# Altium schematic sheet cricket-node.SchDoc
size D; SheetNumber: 2; SheetTotal: 2
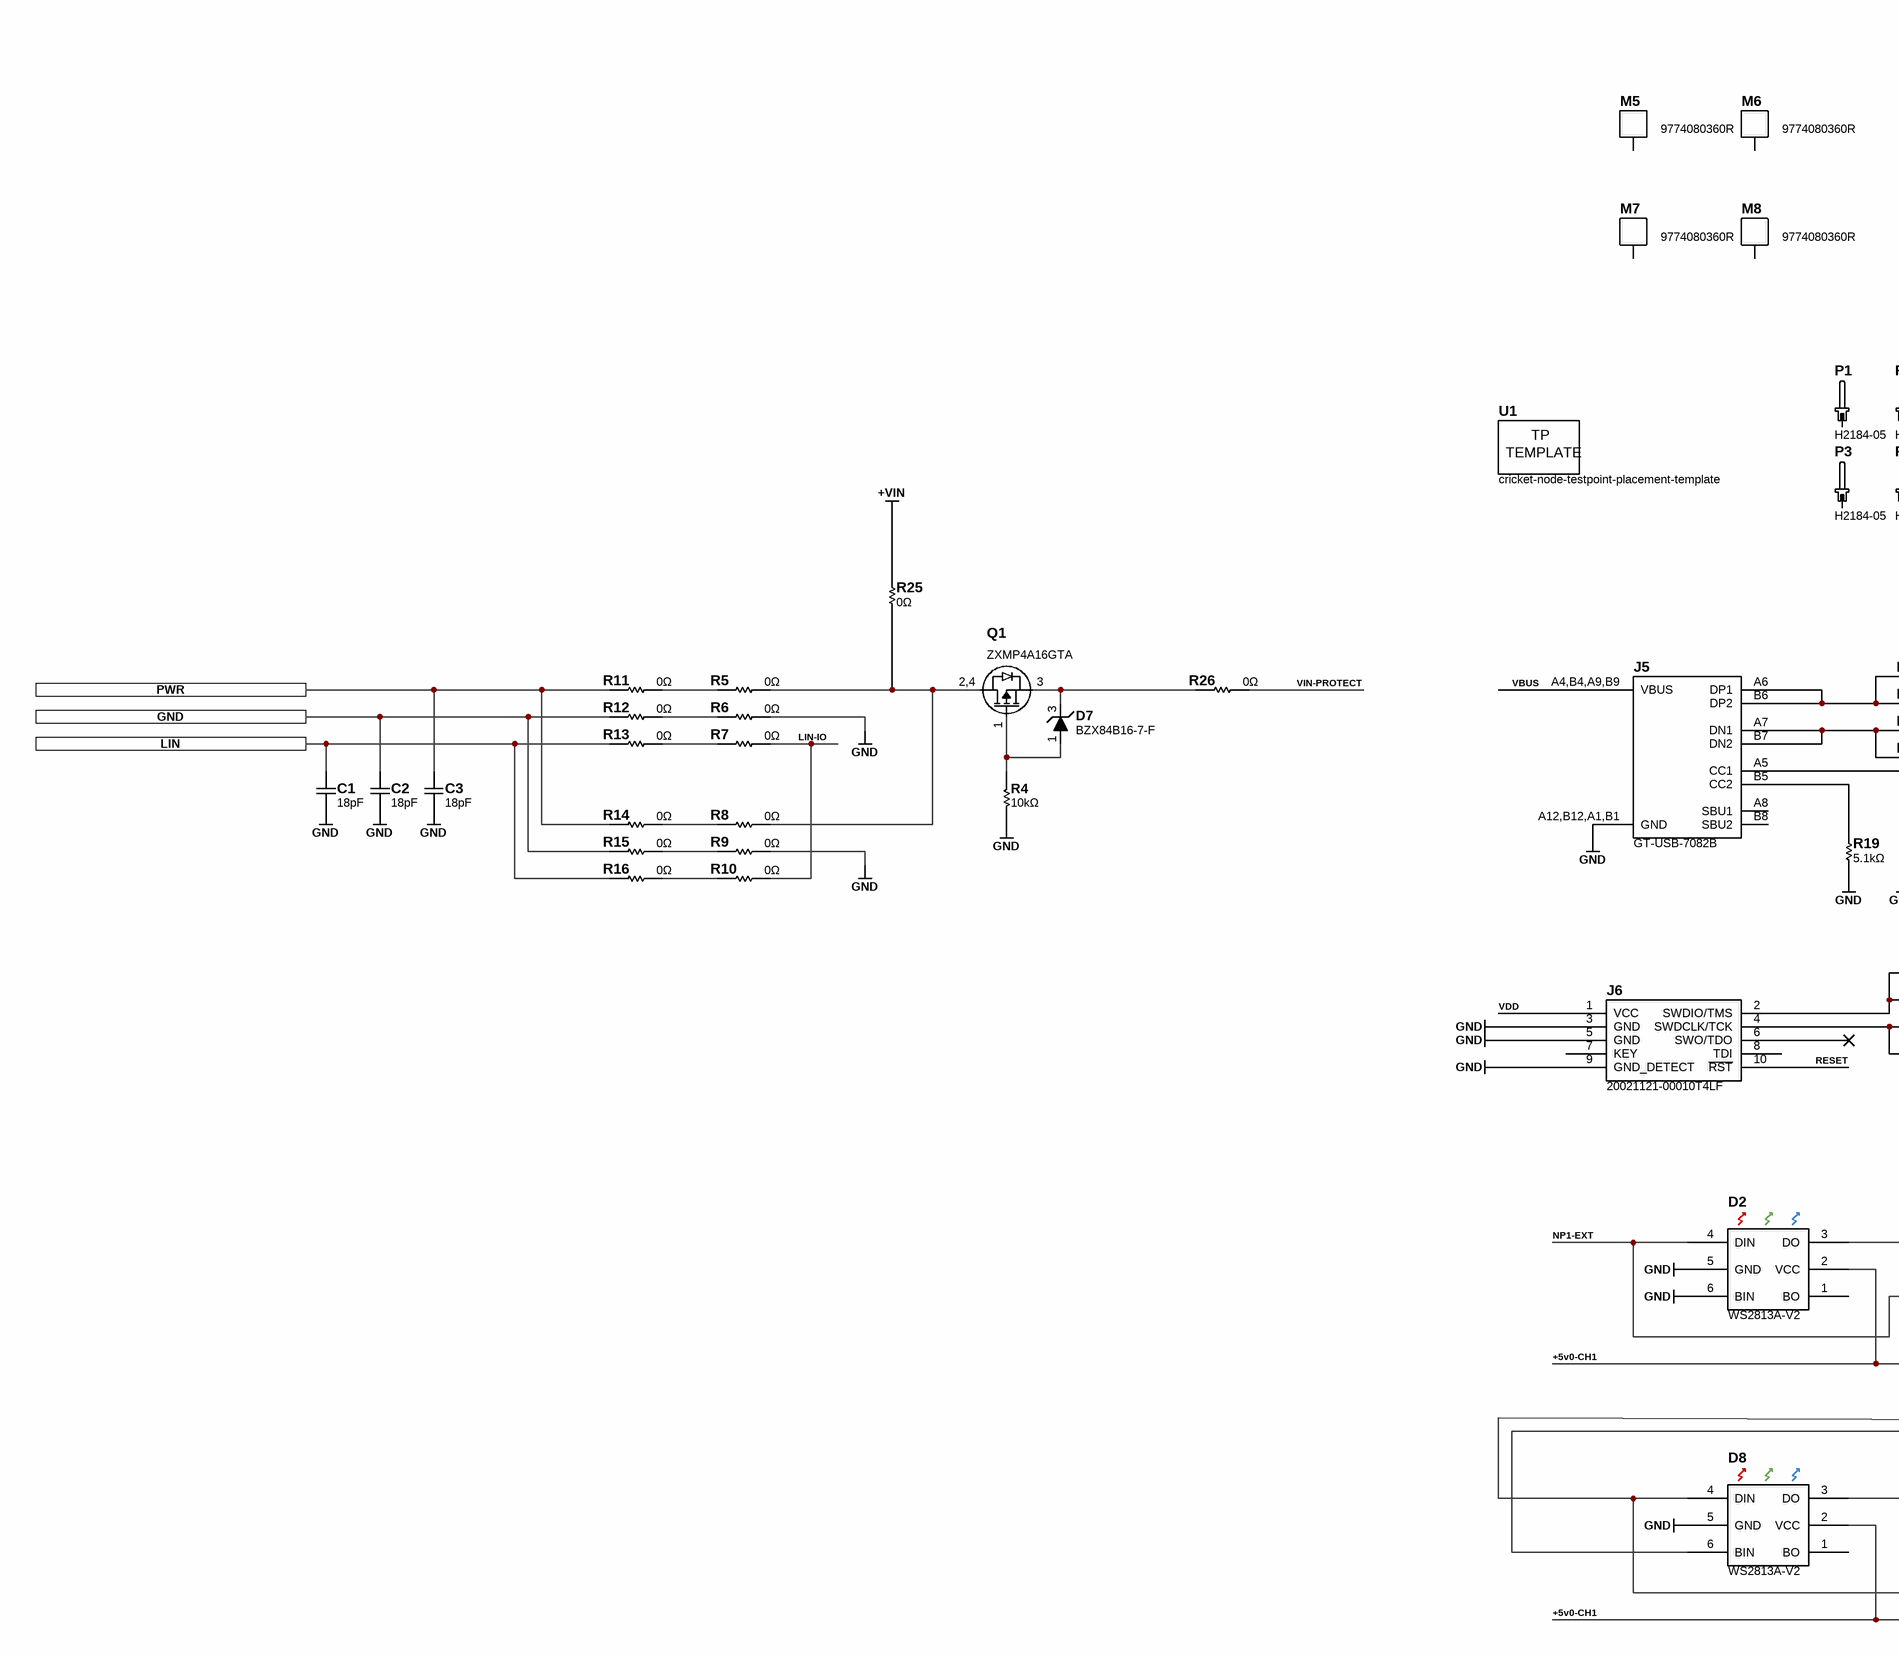
[diagram p0: cricket-node.SchDoc, left]
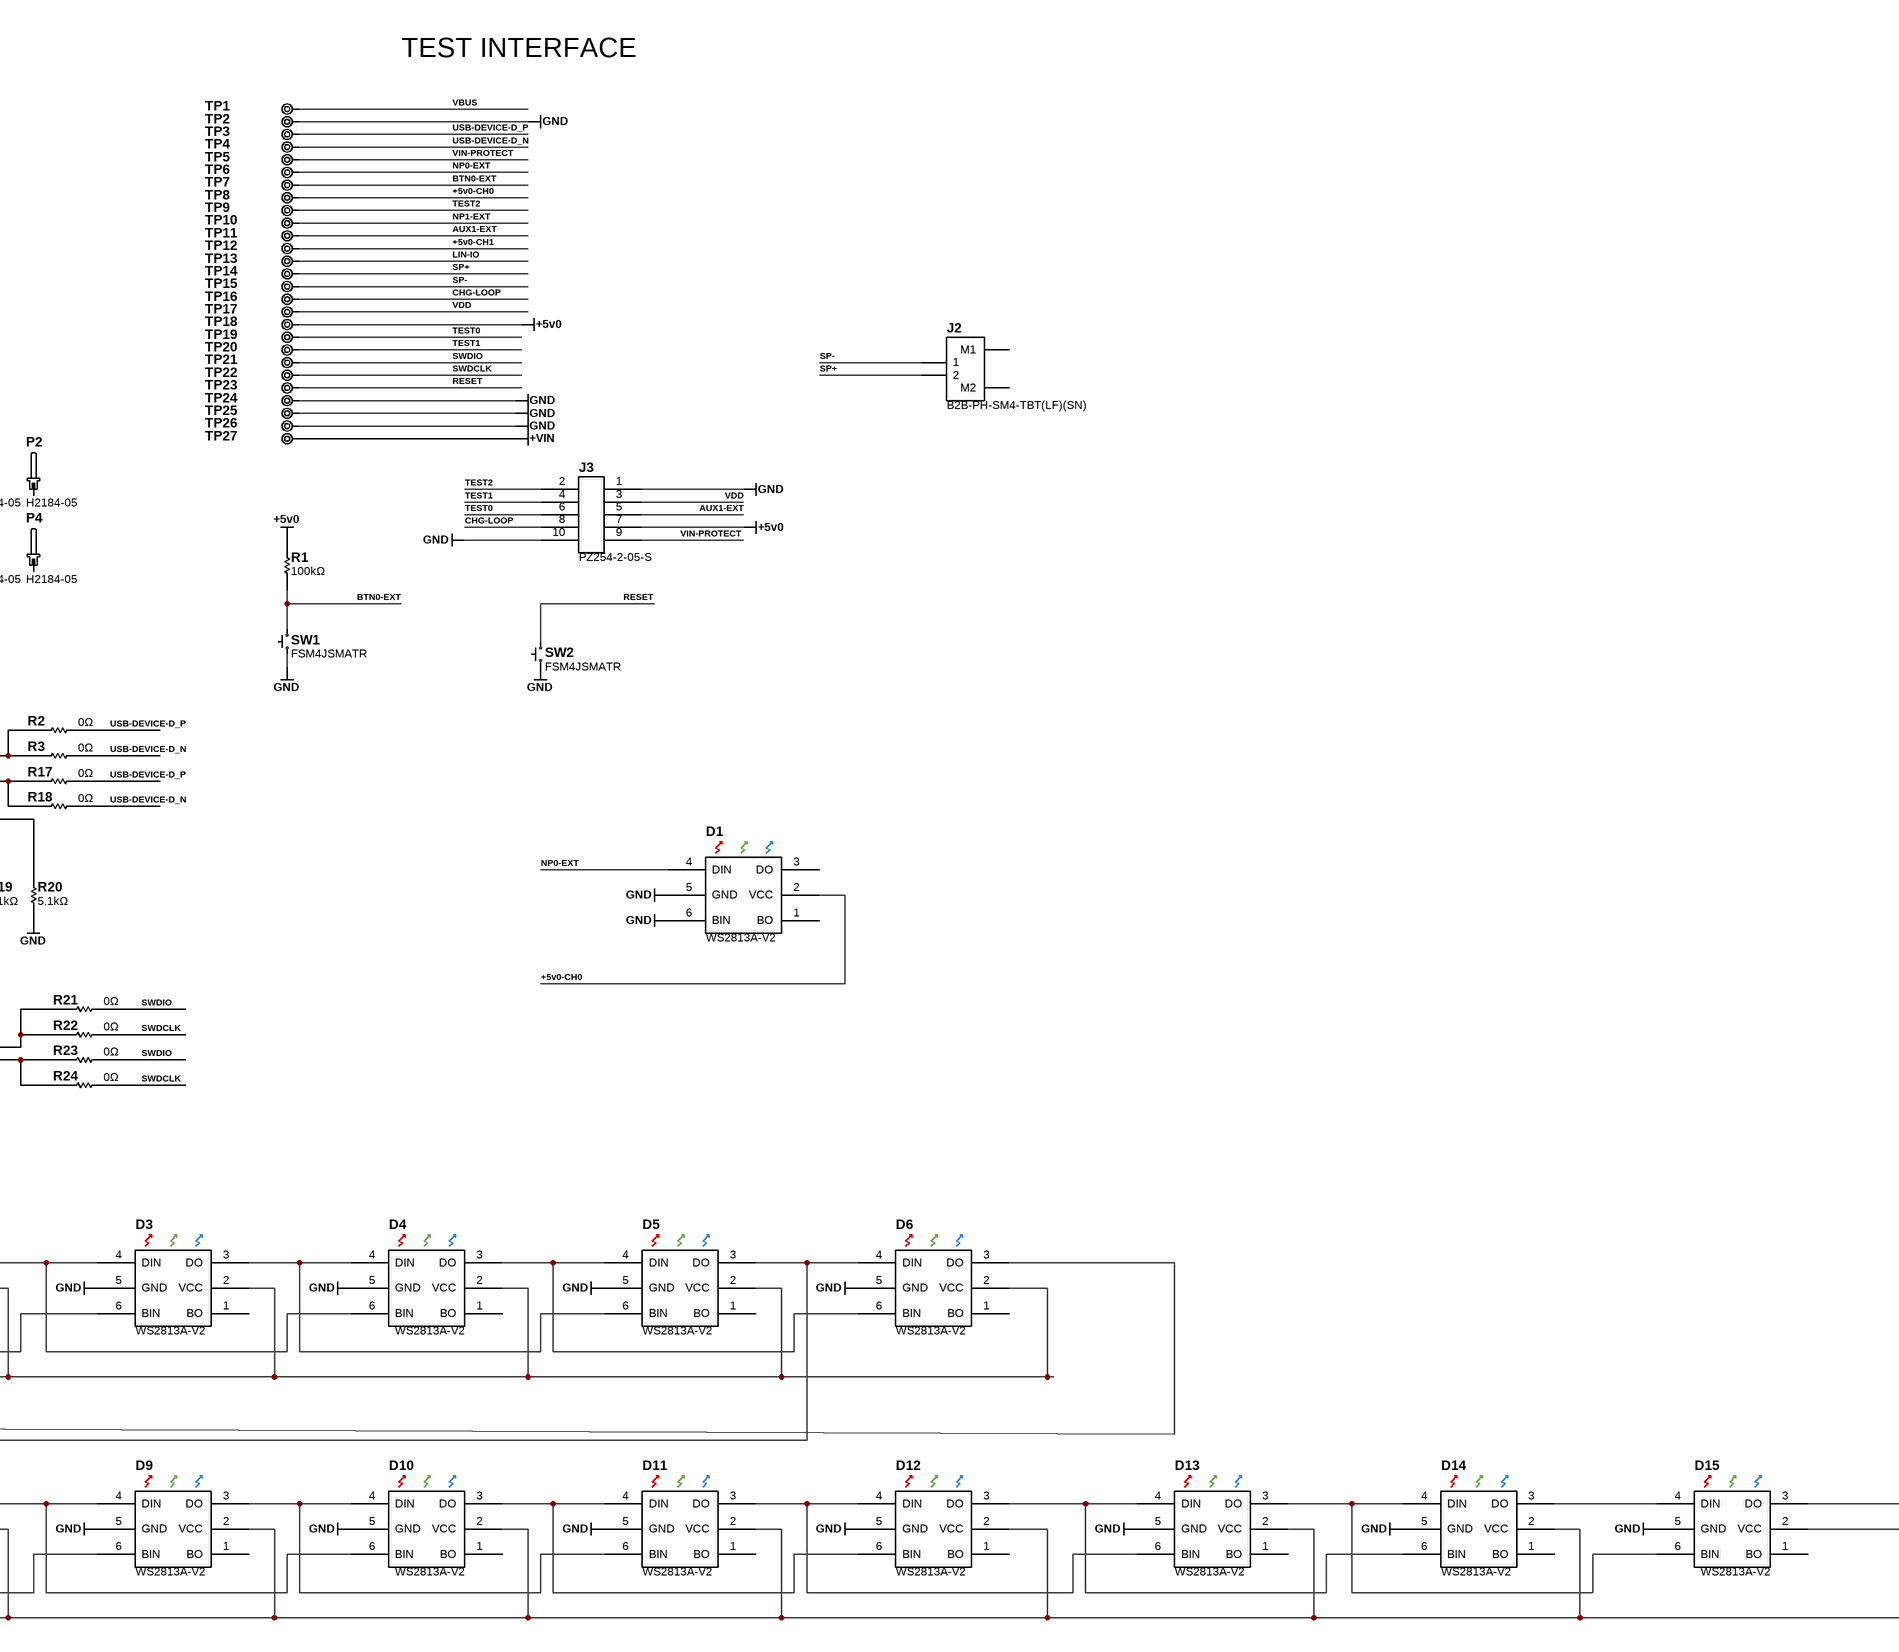
[diagram p1: cricket-node.SchDoc, right]

## Parts
C1  18pF  [C0603_0.90MM_MD]
C2  18pF  [C0603_0.90MM_MD]
C3  18pF  [C0603_0.90MM_MD]
D1  WS2813A-V2  [WS2813A-V2]
D2  WS2813A-V2  [WS2813A-V2]
D3  WS2813A-V2  [WS2813A-V2]
D4  WS2813A-V2  [WS2813A-V2]
D5  WS2813A-V2  [WS2813A-V2]
D6  WS2813A-V2  [WS2813A-V2]
D7  BZX84B16-7-F  [D_SOT-23-3_P]
D8  WS2813A-V2  [WS2813A-V2]
D9  WS2813A-V2  [WS2813A-V2]
D10  WS2813A-V2  [WS2813A-V2]
D11  WS2813A-V2  [WS2813A-V2]
D12  WS2813A-V2  [WS2813A-V2]
D13  WS2813A-V2  [WS2813A-V2]
D14  WS2813A-V2  [WS2813A-V2]
D15  WS2813A-V2  [WS2813A-V2]
J2  B2B-PH-SM4-TBT(LF)(SN)  [B2B-PH-SM4]
J3  PZ254-2-05-S  [PZ254-2-05-S]
J5  GT-USB-7082B  [GT-USB-7082B]
J6  20021121-00010T4LF  [FTSH-105-05-F-DV]
M5  9774080360R  [9774080360R-YIYUAN]
M6  9774080360R  [9774080360R-YIYUAN]
M7  9774080360R  [9774080360R-YIYUAN]
M8  9774080360R  [9774080360R-YIYUAN]
P1  H2184-05  [H2184-05]
P2  H2184-05  [H2184-05]
P3  H2184-05  [H2184-05]
P4  H2184-05  [H2184-05]
Q1  ZXMP4A16GTA  [SOT223]
R1  100kΩ  [R0603_0.55MM_MD]
R2  0Ω  [R0603_0.55MM_HD]
R3  0Ω  [R0603_0.55MM_HD]
R4  10kΩ  [R0603_0.55MM_MD]
R5  0Ω  [R0805_0.70MM_MD]
R6  0Ω  [R0805_0.70MM_MD]
R7  0Ω  [R0805_0.70MM_MD]
R8  0Ω  [R0805_0.70MM_MD]
R9  0Ω  [R0805_0.70MM_MD]
R10  0Ω  [R0805_0.70MM_MD]
R11  0Ω  [R0805_0.70MM_MD]
R12  0Ω  [R0805_0.70MM_MD]
R13  0Ω  [R0805_0.70MM_MD]
R14  0Ω  [R0805_0.70MM_MD]
R15  0Ω  [R0805_0.70MM_MD]
R16  0Ω  [R0805_0.70MM_MD]
R17  0Ω  [R0603_0.55MM_HD]
R18  0Ω  [R0603_0.55MM_HD]
R19  5.1kΩ  [R0603_0.55MM_HD]
R20  5.1kΩ  [R0603_0.55MM_HD]
R21  0Ω  [R0603_0.55MM_HD]
R22  0Ω  [R0603_0.55MM_HD]
R23  0Ω  [R0603_0.55MM_HD]
R24  0Ω  [R0603_0.55MM_HD]
R25  0Ω  [R0603_0.55MM_HD]
R26  0Ω  [R0603_0.55MM_HD]
SW1  FSM4JSMATR  [FSM4JSMATR]
SW2  FSM4JSMATR  [FSM4JSMATR]
TP1  YZ209315103P-01  [YZ209315103P-01]  (value not drawn)
TP2  YZ209315103P-01  [YZ209315103P-01]  (value not drawn)
TP3  YZ209315103P-01  [YZ209315103P-01]  (value not drawn)
TP4  YZ209315103P-01  [YZ209315103P-01]  (value not drawn)
TP5  YZ209315103P-01  [YZ209315103P-01]  (value not drawn)
TP6  YZ209315103P-01  [YZ209315103P-01]  (value not drawn)
TP7  YZ209315103P-01  [YZ209315103P-01]  (value not drawn)
TP8  YZ209315103P-01  [YZ209315103P-01]  (value not drawn)
TP9  YZ209315103P-01  [YZ209315103P-01]  (value not drawn)
TP10  YZ209315103P-01  [YZ209315103P-01]  (value not drawn)
TP11  YZ209315103P-01  [YZ209315103P-01]  (value not drawn)
TP12  YZ209315103P-01  [YZ209315103P-01]  (value not drawn)
TP13  YZ209315103P-01  [YZ209315103P-01]  (value not drawn)
TP14  YZ209315103P-01  [YZ209315103P-01]  (value not drawn)
TP15  YZ209315103P-01  [YZ209315103P-01]  (value not drawn)
TP16  YZ209315103P-01  [YZ209315103P-01]  (value not drawn)
TP17  YZ209315103P-01  [YZ209315103P-01]  (value not drawn)
TP18  YZ209315103P-01  [YZ209315103P-01]  (value not drawn)
TP19  YZ209315103P-01  [YZ209315103P-01]  (value not drawn)
TP20  YZ209315103P-01  [YZ209315103P-01]  (value not drawn)
TP21  YZ209315103P-01  [YZ209315103P-01]  (value not drawn)
TP22  YZ209315103P-01  [YZ209315103P-01]  (value not drawn)
TP23  YZ209315103P-01  [YZ209315103P-01]  (value not drawn)
TP24  YZ209315103P-01  [YZ209315103P-01]  (value not drawn)
TP25  YZ209315103P-01  [YZ209315103P-01]  (value not drawn)
TP26  YZ209315103P-01  [YZ209315103P-01]  (value not drawn)
TP27  YZ209315103P-01  [YZ209315103P-01]  (value not drawn)
U1  cricket-node-testpoint-placement-template  [cricket-node-template]  (no BOM)

## Ports
GND, LIN, PWR

## Nets
+5v0: J3.7 R1.2 TP18.1
+VIN: R25.2 TP27.1
GND: C1.1 C2.1 C3.1 D1.5(GND) D1.6(BIN) D2.5(GND) D2.6(BIN) D3.5(GND) D4.5(GND) D5.5(GND) D6.5(GND) D8.5(GND) D9.5(GND) D10.5(GND) D11.5(GND) D12.5(GND) D13.5(GND) D14.5(GND) D15.5(GND) J3.1 J3.10 J5.A12,B12,A1,B1(GND) J6.3(GND) J6.5(GND) J6.9(GND_DETECT) R4.2 R6.2 R9.2 R19.1 R20.1 SW1.A SW2.A TP2.1 TP24.1 TP25.1 TP26.1
+5v0-CH0: D1.2(VCC) TP8.1
+5v0-CH1: D2.2(VCC) D3.2(VCC) D4.2(VCC) D5.2(VCC) D6.2(VCC) D8.2(VCC) D9.2(VCC) D10.2(VCC) D11.2(VCC) D12.2(VCC) D13.2(VCC) D14.2(VCC) D15.2(VCC) TP12.1
AUX1-EXT: J3.5 TP11.1
BTN0-EXT: R1.1 SW1.B TP7.1
CHG-LOOP: J3.8 TP16.1
GND: C2.2 R12.1 R15.1 ; port GND  [a separate net that carries the same name]
LIN: C1.2 R13.1 R16.1 ; port LIN
LIN-IO: R7.2 R10.2 TP13.1
NP0-EXT: D1.4(DIN) TP6.1
NP1-EXT: D2.4(DIN) D3.6(BIN) TP10.1
PWR: C3.2 R11.1 R14.1 ; port PWR
RESET: J6.10(~{RST}) SW2.B TP23.1
SP+: J2.2 TP14.1
SP-: J2.1 TP15.1
SWDCLK: R22.2 R24.2 TP22.1
SWDIO: R21.2 R23.2 TP21.1
TEST0: J3.6 TP19.1
TEST1: J3.4 TP20.1
TEST2: J3.2 TP9.1
USB-DEVICE-D_N: R3.2 R18.2 TP4.1
USB-DEVICE-D_P: R2.2 R17.2 TP3.1
VBUS: J5.A4,B4,A9,B9(VBUS) TP1.1
VDD: J3.3 J6.1(VCC) TP17.1
VIN-PROTECT: J3.9 R26.2 TP5.1
NetD2_3: D2.3(DO) D3.4(DIN) D4.6(BIN)
NetD3_3: D3.3(DO) D4.4(DIN) D5.6(BIN)
NetD4_3: D4.3(DO) D5.4(DIN) D6.6(BIN)
NetD5_3: D5.3(DO) D6.4(DIN) D8.6(BIN)
NetD6_3: D6.3(DO) D8.4(DIN) D9.6(BIN)
NetD7_1: D7.1(A) Q1.1(G) R4.1
NetD7_3: D7.3(K) Q1.3(S) R26.1
NetD8_3: D8.3(DO) D9.4(DIN) D10.6(BIN)
NetD9_3: D9.3(DO) D10.4(DIN) D11.6(BIN)
NetD10_3: D10.3(DO) D11.4(DIN) D12.6(BIN)
NetD11_3: D11.3(DO) D12.4(DIN) D13.6(BIN)
NetD12_3: D12.3(DO) D13.4(DIN) D14.6(BIN)
NetD13_3: D13.3(DO) D14.4(DIN) D15.6(BIN)
NetD14_3: D14.3(DO) D15.4(DIN)
NetJ5_A5: J5.A5(CC1) R20.2
NetJ5_A6: J5.A6(DP1) J5.B6(DP2) R2.1 R3.1
NetJ5_A7: J5.A7(DN1) J5.B7(DN2) R17.1 R18.1
NetJ5_B5: J5.B5(CC2) R19.2
NetJ6_2: J6.2(SWDIO/TMS) R21.1 R22.1
NetJ6_4: J6.4(SWDCLK/TCK) R23.1 R24.1
NetQ1_2,4: Q1.2,4(D) R5.2 R8.2 R25.1
NetR5_1: R5.1 R11.2
NetR6_1: R6.1 R12.2
NetR7_1: R7.1 R13.2
NetR8_1: R8.1 R14.2
NetR9_1: R9.1 R15.2
NetR10_1: R10.1 R16.2

Not connected (* = marked no-connect by the designer): D1 1(BO) 3(DO); D2 1(BO); D3 1(BO); D4 1(BO); D5 1(BO); D6 1(BO); D8 1(BO); D9 1(BO); D10 1(BO); D11 1(BO); D12 1(BO); D13 1(BO); D14 1(BO); D15 1(BO) 3(DO); J2 M1 M2; J5 A8(SBU1) B8(SBU2); J6 6(SWO/TDO)* 7(KEY) 8(TDI); M5 1; M6 1; M7 1; M8 1; P1 1; P2 1; P3 1; P4 1

## Notes on the sheet
- TEST INTERFACE
- PCB Part Number
- Document Type
- SCHEMATIC DRAWING
- PCB Mixdown
- CCA Part Number
- CCA Mixdown
- Codename
- Engineer
- Date
- Status
- Page
- (in symbol cricket-node-testpoint-placement-template) TP; TEMPLATE

## Library data of the parts
C1-C3 = GCM1885C2A180JA16D: CAP CER 18PF 100V C0G/NP0 0603; Manufacturer: Murata Electronics; Temperature Coefficient: C0G, NP0; kicad-symbol: Capacitor:C_2P_NP; kicad-footprint: C0603_0.90MM_MD:C0603_0.90MM_MD; Tolerance: ±5%; Substitution Notes: 18pF , 100V , ±5% , C0G, NP0 , -55°C ~ 125°C , AEC-Q200 , 0603; Value: 18pF; cad-reference: GCM1885C2A180JA16D; Manufacturer Part Number: GCM1885C2A180JA16D; Category: Capacitors; Voltage - Rated: 100V; Operating Temperature: -55°C ~ 125°C; Ratings: AEC-Q200; Package: 603; Thickness (Max): 0.90MM
D1-D6 D8-D15 = WS2813A-V2: SMD5050 RGB LEDs(Built-in IC) ROHS; Manufacturer: Worldsemi; Value: WS2813A-V2; Manufacturer Part Number: WS2813A-V2; JLCPCB Part #: C5446704
D7 = BZX84B16-7-F: DIODE ZENER 16V 300MW SOT23; Manufacturer: Diodes Inc; CategorySort: 400; Voltage - Forward (Vf) (Max) @ If: 900mV @ 10mA; Current - Reverse Leakage @ Vr: 100nA @ 11.2V; Tolerance: ±2%; Impedance (Max) (Zzt): 40 Ohm; Num Pins: 3; Diode Suffix: 1A_3C; kicad-symbol: Diode:DZ_1A_3C; kicad-footprint: D_SOT-23-3:D_SOT-23-3_P; Category: Diodes; Value: BZX84B16-7-F; Manufacturer Part Number: BZX84B16-7-F; ComponentLink1Description: Internal Datasheet; ComponentLink1URL: http://www.diodes.com/datasheets/BZX84Bxx(x).pdf; ComponentLink2Description: External Datasheet; ComponentLink2URL: http://www.diodes.com/datasheets/BZX84Bxx(x).pdf; Supplier 1: Digi-Key; Supplier Part Number 1: BZX84B16-FDICT-ND; SortValue: BZX84B16-7-F; Voltage - Zener (Nom) (Vz): 16V; Power - Max: 300mW; Mounting Type: Surface Mount; Package: TO-236-3- SC-59- SOT-23-3; Supplier Device Package: SOT-23-3; Packaging: Cut Tape (CT); Operating Temperature: -65°C ~ 150°C; JLCPCB Part #: C968217; cad-reference: BZX84B16-7-F
J2 = B2B-PH-SM4-TBT(LF)(SN): JST 2MM Vertical 2 Pin; Number of Positions: 2; Connector Type: Header; Current Rating: 2A; Pitch: 0.079inch; kicad-symbol: B2B-PH-SM4-TBT(LF)(SN):B2B-PH-SM4-TBT(LF)(SN); Supplier 1: Digi-Key; Supplier Part Number 1: 455-2872-6-ND; Manufacturer: JST; Manufacturer Part Number: B2B-PH-SM4-TBT(LF)(SN); RoHS: Yes; Category: connectors; Pricing: 1=0.76000, 10=0.66600, 100=0.54870, 500=0.47710 (USD); Mount: Surface Mount; Color: Natural; Contact Plating: Tin; Contact Material: Copper Alloy; Contact Shape: Square; Contact Finish - Mating: TIN; Insulation Material: Nylon; Insulation Color: Natural; Min Operating Temperature: -25°C; Max Operating Temperature: 85°C; Packaging: Cut Tape; Number of Rows: 1; Series: PH; Contact Type: Male Pin; Package Quantity: 1; Fastening Type: Detent; Termination: Solder; Contact Mating Length: 0.13inch; Lead Free: Lead Free; Flammability Rating: UL94 V-0; ComponentLink1URL: https://datasheet.ciiva.com/26894/getdatasheetpartid-473167-26894757.pdf?src-supplier=Verical; ComponentLink1Description: https://datasheet.ciiva.com/26894/getdatasheetpartid-473167-26894757.pdf?src-supplier=Verical; ComponentLink2URL: https://datasheet.ciiva.com/14800/eph-14800607.pdf?src-supplier=Digi-Key; ComponentLink2Description: https://datasheet.ciiva.com/14800/eph-14800607.pdf?src-supplier=Digi-Key; ComponentLink3URL: https://datasheet.ciiva.com/732/eph-732907.pdf?src-supplier=Digi-Key; ComponentLink3Description: https://datasheet.ciiva.com/732/eph-732907.pdf?src-supplier=Digi-Key; Value: B2B-PH-SM4-TBT(LF)(SN); cad-reference: B2B-PH-SM4-TBT(LF)(SN); kicad-footprint: B2B-PH-SM4-TBT(LF)(SN):B2B-PH-SM4-TBT(LF)(SN); Internal Part Number: B2B-PH-SM4-TBT(LF)(SN); JLCPCB Part #: C265003
J3 = PZ254-2-05-S: 250V 3A Standing paste Policy 2.5mm 260℃@5S 6mm 10P -40℃~+105℃ 2.54mm Double Row Black 2.54mm 2x5P SMD,P=2.54mm  Pin Headers ROHS; Manufacturer: HCTL; kicad-symbol: CON-2-5:CON-2-5; kicad-footprint: PZ254-2-05-S:PZ254-2-05-S; cad-reference: PZ254-2-05-S; Manufacturer Part Number: PZ254-2-05-S; JLCPCB Part #: C3294463; Value: PZ254-2-05-S
J5 = GT-USB-7082B: USB-C Vertical - USB2.0 Pinout; Manufacturer: G-Switch; kicad-symbol: GT-USB-7082B:GT-USB-7082B; cad-reference: GT-USB-7082B; kicad-footprint: GT-USB-7082B:GT-USB-7082B; Manufacturer Part Number: GT-USB-7082B; JLCPCB Part #: C3001290; Value: GT-USB-7082B
J6 = 20021121-00010T4LF: Connector Header Surface Mount 10 position 0.050" (1.27mm); Manufacturer: Amphenol ICC; kicad-symbol: CORTEX-DEBUG:CORTEX-DEBUG; kicad-footprint: FTSH-105-05-F-DV:FTSH-105-05-F-DV; cad-reference: 20021121-00010T4LF; Manufacturer Part Number: 20021121-00010T4LF; JLCPCB Part #: C598540; Value: 20021121-00010T4LF
M5-M8 = 9774080360R: ROUND STANDOFF M3X0.5 STEEL 8MM; Manufacturer: Würth Elektronik; Manufacturer 1: YIYUAN; Manufacturer Part Number 1: SMTSOM380BTR; kicad-symbol: standoff-smt:standoff-smt; kicad-footprint: 9774080360R:9774080360R; cad-reference: 9774080360R; Manufacturer Part Number: 9774080360R; JLCPCB Part #: C5301772; Value: 9774080360R
P1-P4 = H2184-05: PC Pin Terminal Connector Through Hole Gold 0.070" (1.78mm) Dia; Manufacturer: Harwin; Value: H2184-05; cad-reference: H2184-05; Manufacturer Part Number: H2184-05; JLCPCB Part #: C17507717
Q1 = ZXMP4A16GTA: MOSFET P-CH 40V 6.4A SOT223; Manufacturer: Diodes Incorporated; kicad-symbol: MOSFET-P-CH-1G2D4D3S:MOSFET-P-CH-1G2D4D3S; kicad-footprint: SOT223:SOT223; Value: ZXMP4A16GTA; cad-reference: ZXMP4A16GTA; Manufacturer Part Number: ZXMP4A16GTA; JLCPCB Part #: C141324
R1 = ERJ-3EKF1003V: RES 100K OHM 1/10W 1% 0603 SMD; Manufacturer: Panasonic Electronic Components; Package Power: 0603  (0.1W); kicad-symbol: Resistor:R_2P; kicad-footprint: R0603_0.55MM_HD:R0603_0.55MM_HD; Power (Watts): 0.1W- 1/10W; Temperature Coefficient: ±100ppm/°C; Limiting Element Voltage: 75; Maximum Overload Voltage: 150; Maximum Working Voltage: 75.0V; Substitution Notes: 100k , ±1% , 0603 , AEC-Q200; Value: 100kΩ; cad-reference: ERJ-3EKF1003V; Manufacturer Part Number: ERJ-3EKF1003V; JLCPCB Part #: C189597; Manufacturer 1: Panasonic Electronic Components; Manufacturer Part Number 1: ERJ-3EKF1003V; Category: Resistors; Resistance (Ohms): 100k; Composition: Thick Film; Features: -; Tolerance: ±1%; Package: 0603 (1608 Metric); Supplier Package: 603; Height: 0.55MM; Number of Terminations: 2; Packaging: Cut Tape (CT); Sort Value: 100000.0; Sort Value Package: 603_100000; Ratings: AEC-Q200
R2 R3 R17 R18 R21-R26 = ERJ-3GEY0R00V: RES 0.0 OHM 1/10W JUMP 0603 SMD; Manufacturer: Panasonic Electronic Components; Package Power: 0603  (0.1W); kicad-symbol: Resistor:R_2P; kicad-footprint: R0603_0.55MM_HD:R0603_0.55MM_HD; Resistance (Ohms): 0; Power (Watts): 0.1W- 1/10W; Tolerance: Jumper; Limiting Element Voltage: 75; Maximum Overload Voltage: 150; Maximum Working Voltage: 0.0V; Substitution Notes: 0 , Jumper , 0603 , AEC-Q200; Value: 0Ω; cad-reference: ERJ-3GEY0R00V; Manufacturer Part Number: ERJ-3GEY0R00V; Manufacturer 1: Panasonic Electronic Components; Manufacturer Part Number 1: ERJ-3GEY0R00V; Supplier 1: Digi-Key; Supplier Part Number 1: P0.0GCT-ND; Category: Resistors; Composition: Thick Film; Features: -; Temperature Coefficient: -; Package: 0603 (1608 Metric); Supplier Package: 603; Height: 0.55MM; Number of Terminations: 2; Sort Value: 0; Sort Value Package: 603_0; Ratings: AEC-Q200; JLCPCB Part #: C122704
R4 = ERJ-3EKF1002V: RES 10K OHM 1/10W 1% 0603 SMD; Manufacturer: Panasonic Electronic Components; Package Power: 0603  (0.1W); Power (Watts): 0.1W- 1/10W; Temperature Coefficient: ±100ppm/°C; Limiting Element Voltage: 75; Maximum Overload Voltage: 150; Maximum Working Voltage: 31.6V; Substitution Notes: 10k , ±1% , 0603 , AEC-Q200; id: 5025; is_external: 1; Value: 10kΩ; Manufacturer Part Number: ERJ-3EKF1002V; Category: Resistors; Resistance (Ohms): 10k; Composition: Thick Film; Features: -; Tolerance: ±1%; Package: 0603 (1608 Metric); Supplier Package: 0603; Size / Dimension: 0.063" L x 0.031" W (1.60mm x 0.80mm); Height: 0.55MM; Number of Terminations: 2; Packaging: Cut Tape (CT); Sort Value: 10000; Sort Value Package: 603_10000; Ratings: AEC-Q200; JLCPCB Part #: C191124; Manufacturer 1: Panasonic Electronic Components; Manufacturer Part Number 1: ERJ-3EKF1002V
R5-R16 = ERJ-6GEY0R00V: RES 0.0 OHM 1/8W JUMP 0805 SMD; Manufacturer: Panasonic Electronic Components; Package Power: 0805  (0.125W); kicad-symbol: Resistor:R_2P; kicad-footprint: R0805_0.70MM_HD:R0805_0.70MM_HD; Resistance (Ohms): 0; Power (Watts): 0.125W- 1/8W; Tolerance: Jumper; Limiting Element Voltage: 150; Maximum Overload Voltage: 200; Maximum Working Voltage: 0.0V; Substitution Notes: 0 , Jumper , 0805 , AEC-Q200; Value: 0Ω; cad-reference: ERJ-6GEY0R00V; Manufacturer Part Number: ERJ-6GEY0R00V; Manufacturer 1: Panasonic Electronic Components; Manufacturer Part Number 1: ERJ-6GEY0R00V; Supplier 1: Digi-Key; Supplier Part Number 1: P0.0ACT-ND; Category: Resistors; Composition: Thick Film; Features: -; Temperature Coefficient: -; Package: 0805 (2012 Metric); Supplier Package: 805; Height: 0.70MM; Number of Terminations: 2; Sort Value: 0; Sort Value Package: 805_0; Ratings: AEC-Q200; JLCPCB Part #: C96345
R19 R20 = ERJ-3EKF5101V: RES 5.1K OHM 1/10W 1% 0603 SMD; Manufacturer: Panasonic Electronic Components; Package Power: 0603  (0.1W); kicad-symbol: Resistor:R_2P; kicad-footprint: R0603_0.55MM_HD:R0603_0.55MM_HD; Power (Watts): 0.1W- 1/10W; Temperature Coefficient: ±100ppm/°C; Limiting Element Voltage: 75; Maximum Overload Voltage: 150; Maximum Working Voltage: 22.6V; Substitution Notes: 5.1k , ±1% , 0603 , AEC-Q200; Value: 5.1kΩ; cad-reference: ERJ-3EKF5101V; Manufacturer Part Number: ERJ-3EKF5101V; JLCPCB Part #: C169254; Manufacturer 1: Panasonic Electronic Components; Manufacturer Part Number 1: ERJ-3EKF5101V; Category: Resistors; Resistance (Ohms): 5.1k; Composition: Thick Film; Features: -; Tolerance: ±1%; Package: 0603 (1608 Metric); Supplier Package: 603; Height: 0.55MM; Number of Terminations: 2; Packaging: Cut Tape (CT); Sort Value: 5100.0; Sort Value Package: 603_5100; Ratings: AEC-Q200
SW1 SW2 = FSM4JSMATR: SWITCH TACTILE SPST-NO 0.05A 24V; Manufacturer: TE Connectivity ALCOSWITCH Switches; Manufacturer 1: HCTL; Manufacturer Part Number 1: TC-6601-6-260G; kicad-symbol: FSM4JSMATR:FSM4JSMATR; cad-reference: FSM4JSMATR; kicad-footprint: FSM4JSMATR:FSM4JSMATR; Manufacturer Part Number: FSM4JSMATR; JLCPCB Part #: C2845316; Value: FSM4JSMATR
TP1-TP27 = YZ209315103P-01: Brass 12V -40℃~+85℃ 1P Spring loaded pin (POGO PIN) 10.3mm 50mΩ 10,000 times 7mm 2A Gold Pogo Pin Spring Probe Connector ROHS; Manufacturer: Xinyangze; kicad-symbol: YZ209315103P-01:YZ209315103P-01; Value: YZ209315103P-01; cad-reference: YZ209315103P-01; kicad-footprint: YZ209315103P-01:YZ209315103P-01; Internal Part Number: YZ209315103P-01; Manufacturer Part Number: YZ209315103P-01; JLCPCB Part #: C5157328
U1 = cricket-node-testpoint-placement-template: Manufacturer: Wavenumber; flags: NOBOM; Value: cricket-node-testpoint-placement-template; cad-reference: cricket-node-testpoint-placement-template; Manufacturer Part Number: cricket-node-testpoint-placement-template